# Altium schematic sheet Schemat_top.SchDoc
size A4; Author: Michał Wojna; CompanyName: AGH; Revision: 1; ProjectName: Lab. Proj. PCB
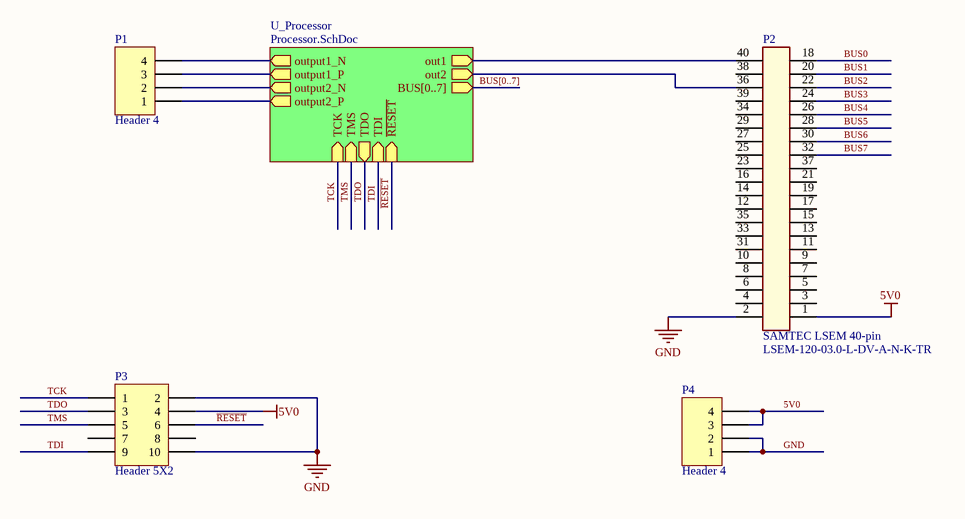
[diagram p0: Schemat_top.SchDoc]

## Parts
P1  Header 4  [HDR1X4]
P2  SAMTEC LSEM 40-pin  [LSEM-120-03.0-L-DV-A-N-K-TR]
P3  Header 5X2  [HDR2X5]
P4  Header 4  [HDR1X4]

## Sub-sheets
U_Processor = Processor.SchDoc: out1 (out), out2 (out), TCK (in), TMS (in), TDO (out), TDI (in), ~{RESET} (in), BUS[0..7] (out), output1_N (out), output1_P (out), output2_N (out), output2_P (out)

## Nets
5V0: P2.1(PIN) P3.4 P4.3 P4.4
GND: P2.2 P3.2 P3.10 P4.1 P4.2
BUS0: P2.18
BUS1: P2.20
BUS2: P2.22
BUS3: P2.24
BUS4: P2.26
BUS5: P2.28
BUS6: P2.30
BUS7: P2.32
~{RESET}: P3.6 ; sheet U_Processor/~{RESET}
TCK: P3.1 ; sheet U_Processor/TCK
TDI: P3.9 ; sheet U_Processor/TDI
TDO: P3.3 ; sheet U_Processor/TDO
TMS: P3.5 ; sheet U_Processor/TMS
NetP1_1: P1.1 ; sheet U_Processor/output2_P
NetP1_2: P1.2 ; sheet U_Processor/output2_N
NetP1_3: P1.3 ; sheet U_Processor/output1_P
NetP1_4: P1.4 ; sheet U_Processor/output1_N
NetP2_36: P2.36 ; sheet U_Processor/out2
NetP2_40: P2.40 ; sheet U_Processor/out1

Not connected (* = marked no-connect by the designer): P2 3(PIN) 4(3) 5(PIN) 6(4) 7(PIN) 8(5) 9(PIN) 10(6) 11(PIN) 12(7) 13(PIN) 14(8) 15(PIN) 16(9) 17(PIN) 19(PIN) 21(PIN) 23(PIN) 25(PIN) 27(PIN) 29(PIN) 31(PIN) 33(PIN) 34(18) 35(PIN) 37(PIN) 38(20) 39(PIN); P3 7 8

## Buses and harness runs
bus BUS[0..7] = sheet U_Processor/BUS[0..7]

## Notes on the sheet
- Company Confidential / Not for distribution !
- Project name:
- Document Name:
- Designer Name:
- Date / Time:
- Revision:

## Library data of the parts
P1 P4 = Header 4: Header, 4-Pin; LatestRevisionDate: 17-Jul-2002; LatestRevisionNote: Re-released for DXP Platform.; Publisher: Altium Limited
P2 = SAMTEC LSEM 40-pin: Component desciption; helpurl: *; Manufacture: SAMTEC; Supplier 1: Farnell; Supplier Part Number 1: 2433813; Part Number: LSEM-120-03.0-L-DV-A-N-K-TR
P3 = Header 5X2: Header, 5-Pin, Dual row; LatestRevisionDate: 17-Jul-2002; LatestRevisionNote: Re-released for DXP Platform.; Publisher: Altium Limited